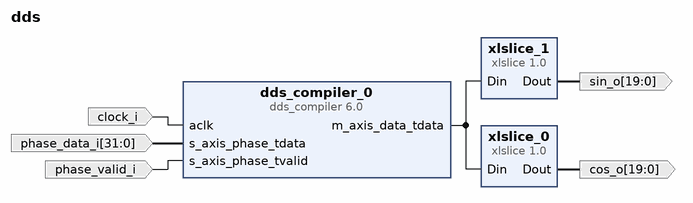
[diagram p0: block diagram of the top level]
# Vivado block design dds, xc7z020clg484-1, Vivado 2024.1
create_bd_design dds

create_bd_port -dir O -from 19 -to 0 -type data cos_o
create_bd_port -dir O -from 19 -to 0 -type data sin_o
create_bd_port -dir I clock_i
create_bd_port -dir I phase_valid_i
create_bd_port -dir I -from 31 -to 0 -type data phase_data_i

create_bd_cell -type ip -vlnv xilinx.com:ip:dds_compiler:6.0 dds_compiler_0
set_property -dict [list \
  CONFIG.DATA_Has_TLAST Not_Required \
  CONFIG.Has_Phase_Out false \
  CONFIG.Latency 1 \
  CONFIG.Latency_Configuration Configurable \
  CONFIG.M_DATA_Has_TUSER Not_Required \
  CONFIG.Noise_Shaping Taylor_Series_Corrected \
  CONFIG.OUTPUT_FORM Twos_Complement \
  CONFIG.Output_Frequency1 0 \
  CONFIG.Output_Width 20 \
  CONFIG.PINC1 0 \
  CONFIG.Parameter_Entry Hardware_Parameters \
  CONFIG.PartsPresent SIN_COS_LUT_only \
  CONFIG.Phase_Width 25 \
  CONFIG.S_PHASE_Has_TUSER Not_Required \
] [get_bd_cells dds_compiler_0]
create_bd_cell -type ip -vlnv xilinx.com:ip:xlslice:1.0 xlslice_0
set_property -dict {CONFIG.DIN_FROM 19 CONFIG.DIN_TO 0 CONFIG.DIN_WIDTH 48 CONFIG.DOUT_WIDTH 20} [get_bd_cells xlslice_0]
create_bd_cell -type ip -vlnv xilinx.com:ip:xlslice:1.0 xlslice_1
set_property -dict {CONFIG.DIN_FROM 43 CONFIG.DIN_TO 24 CONFIG.DIN_WIDTH 48} [get_bd_cells xlslice_1]

# ---- connections ----

connect_bd_net [get_bd_ports clock_i] [get_bd_pins dds_compiler_0/aclk]
connect_bd_net [get_bd_pins dds_compiler_0/m_axis_data_tdata] [get_bd_pins xlslice_0/Din] [get_bd_pins xlslice_1/Din]
connect_bd_net [get_bd_ports phase_data_i] [get_bd_pins dds_compiler_0/s_axis_phase_tdata]
connect_bd_net [get_bd_ports phase_valid_i] [get_bd_pins dds_compiler_0/s_axis_phase_tvalid]
connect_bd_net [get_bd_pins xlslice_0/Dout] [get_bd_ports cos_o]
connect_bd_net [get_bd_pins xlslice_1/Dout] [get_bd_ports sin_o]

validate_bd_design
save_bd_design
